# Altium project lightning_main.PrjPCB
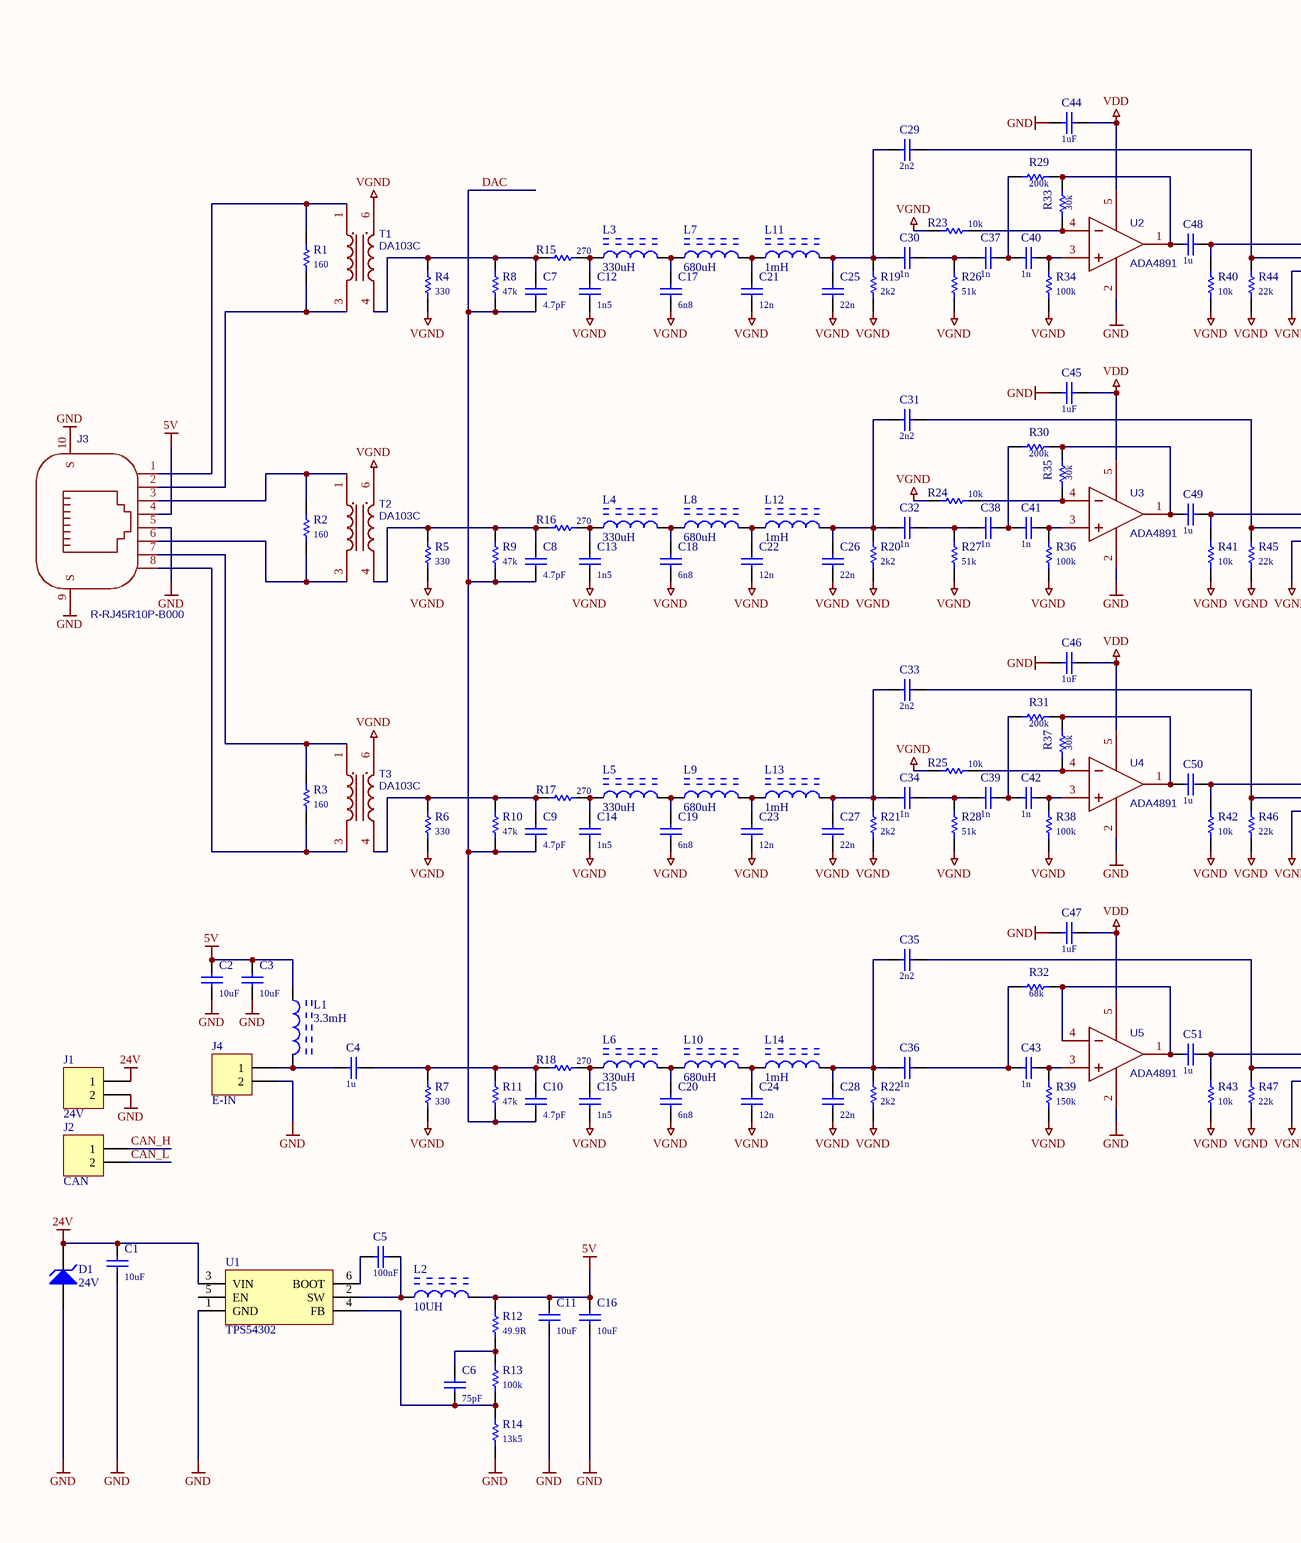
[diagram p0: schematic.SchDoc, left]
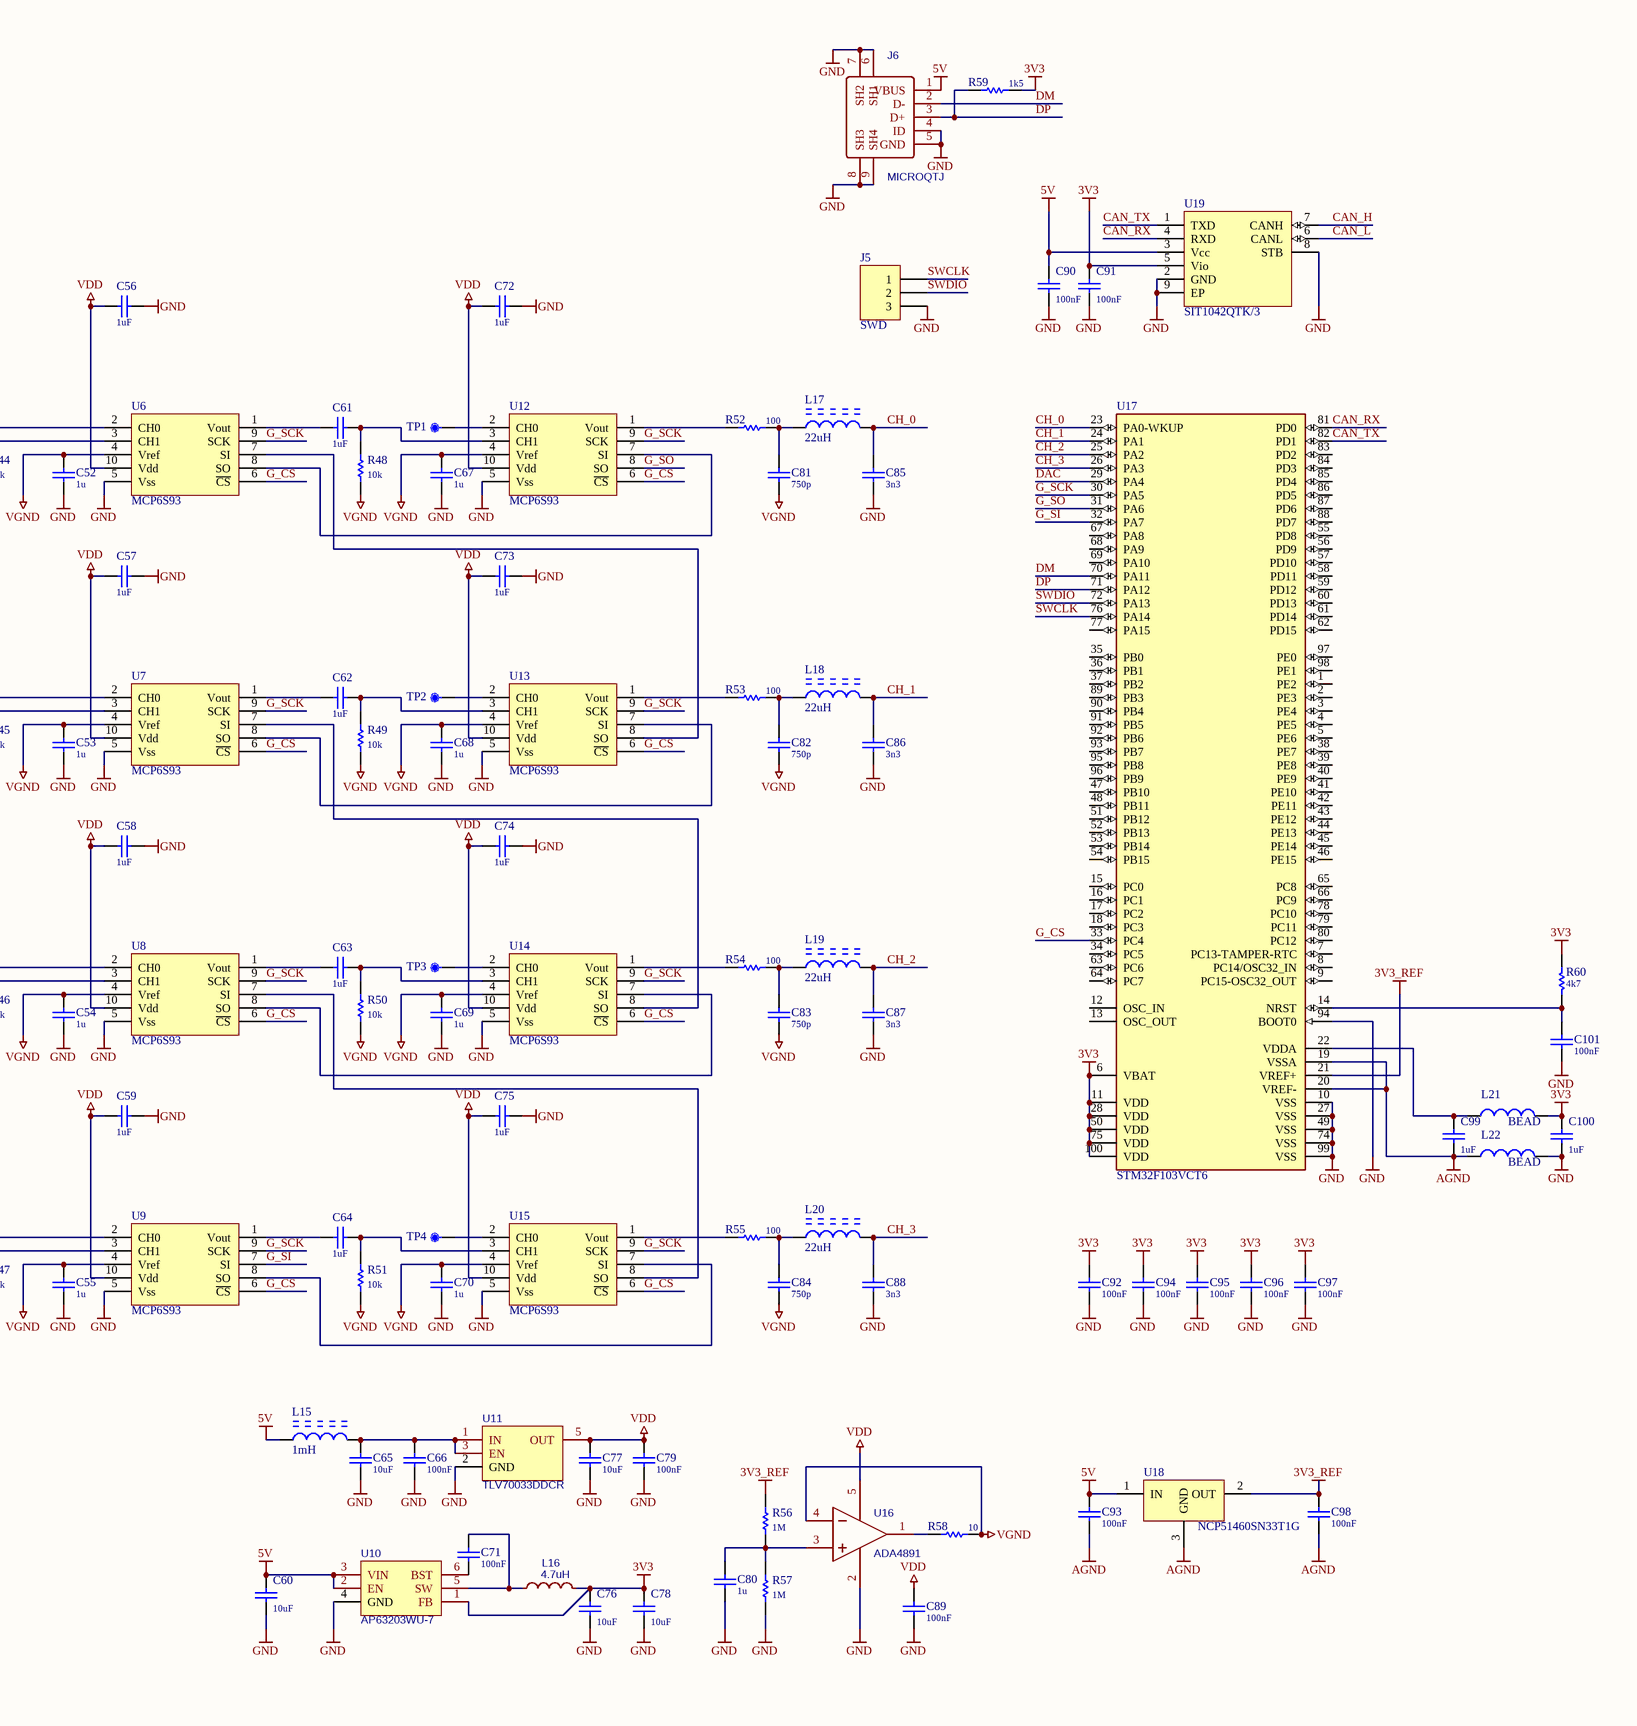
[diagram p1: schematic.SchDoc, right]
PRJ_VER: v1.0.0
1 sheet, 216 parts. Net scope: global (net labels, ports and power ports of the same name join across sheets).
Board file: board.PcbDoc

## Sheet schematic.SchDoc
size A2; SheetNumber: 6; SheetTotal: 29

### Parts
C1  10uF  [C1206]
C2  10uF  [C1206]
C3  10uF  [C1206]
C4  1u  [C0603]
C5  100nF  [C0603]
C6  75pF  [C0603]
C7  4.7pF  [C0603]
C8  4.7pF  [C0603]
C9  4.7pF  [C0603]
C10  4.7pF  [C0603]
C11  10uF  [C1206]
C12  1n5  [C0603]
C13  1n5  [C0603]
C14  1n5  [C0603]
C15  1n5  [C0603]
C16  10uF  [C1206]
C17  6n8  [C0603]
C18  6n8  [C0603]
C19  6n8  [C0603]
C20  6n8  [C0603]
C21  12n  [C0603]
C22  12n  [C0603]
C23  12n  [C0603]
C24  12n  [C0603]
C25  22n  [C0603]
C26  22n  [C0603]
C27  22n  [C0603]
C28  22n  [C0603]
C29  2n2  [C0603]
C30  1n  [C0603]
C31  2n2  [C0603]
C32  1n  [C0603]
C33  2n2  [C0603]
C34  1n  [C0603]
C35  2n2  [C0603]
C36  1n  [C0603]
C37  1n  [C0603]
C38  1n  [C0603]
C39  1n  [C0603]
C40  1n  [C0603]
C41  1n  [C0603]
C42  1n  [C0603]
C43  1n  [C0603]
C44  1uF  [C0603]
C45  1uF  [C0603]
C46  1uF  [C0603]
C47  1uF  [C0603]
C48  1u  [C0603]
C49  1u  [C0603]
C50  1u  [C0603]
C51  1u  [C0603]
C52  1u  [C0603]
C53  1u  [C0603]
C54  1u  [C0603]
C55  1u  [C0603]
C56  1uF  [C0603]
C57  1uF  [C0603]
C58  1uF  [C0603]
C59  1uF  [C0603]
C60  10uF  [C1206]
C61  1uF  [C0603]
C62  1uF  [C0603]
C63  1uF  [C0603]
C64  1uF  [C0603]
C65  10uF  [C0805]
C66  100nF  [C0603]
C67  1u  [C0603]
C68  1u  [C0603]
C69  1u  [C0603]
C70  1u  [C0603]
C71  100nF  [C0402]
C72  1uF  [C0603]
C73  1uF  [C0603]
C74  1uF  [C0603]
C75  1uF  [C0603]
C76  10uF  [C1206]
C77  10uF  [C0805]
C78  10uF  [C1206]
C79  100nF  [C0603]
C80  1u  [C0603]
C81  750p  [C0603]
C82  750p  [C0603]
C83  750p  [C0603]
C84  750p  [C0603]
C85  3n3  [C0603]
C86  3n3  [C0603]
C87  3n3  [C0603]
C88  3n3  [C0603]
C89  100nF  [C0603]
C90  100nF  [C0402]
C91  100nF  [C0402]
C92  100nF  [C0402]
C93  100nF  [C0603]
C94  100nF  [C0402]
C95  100nF  [C0402]
C96  100nF  [C0402]
C97  100nF  [C0402]
C98  100nF  [C0603]
C99  1uF  [C0603]
C100  1uF  [C0603]
C101  100nF  [C0402]
D1  24V  [SMB]
J1  24V  [CONN_DG308-2.54-2P]
J2  CAN  [CONN_DG308-2.54-2P]
J3  R-RJ45R10P-B000  [RJ45-TH_R-RJ45R10P-B000]
J4  E-IN  [CONN_F_TYPE]
J5  SWD  [HDR-1X3]  (no BOM)
J6  MICROQTJ  [MICRO-USB-SMD_MICROQTJ]
L1  3.3mH  [IND-TH_BD5.0-L10.5-P14.50-D0.6]
L2  10UH  [IND-SMD_L7.2-W6.6_GPSR07X0]
L3  330uH  [L1210]
L4  330uH  [L1210]
L5  330uH  [L1210]
L6  330uH  [L1210]
L7  680uH  [L1210]
L8  680uH  [L1210]
L9  680uH  [L1210]
L10  680uH  [L1210]
L11  1mH  [L1210]
L12  1mH  [L1210]
L13  1mH  [L1210]
L14  1mH  [L1210]
L15  1mH  [L1210]
L16  4.7uH  [IND-SMD_L4.4-W4.2]
L17  22uH  [L1210]
L18  22uH  [L1210]
L19  22uH  [L1210]
L20  22uH  [L1210]
L21  BEAD  [L0402]
L22  BEAD  [L0402]
R1  160  [R0603]
R2  160  [R0603]
R3  160  [R0603]
R4  330  [R0603]
R5  330  [R0603]
R6  330  [R0603]
R7  330  [R0603]
R8  47k  [R0603]
R9  47k  [R0603]
R10  47k  [R0603]
R11  47k  [R0603]
R12  49.9R  [R0603]
R13  100k  [R0603]
R14  13k5  [R0603]
R15  270  [R0603]
R16  270  [R0603]
R17  270  [R0603]
R18  270  [R0603]
R19  2k2  [R0603]
R20  2k2  [R0603]
R21  2k2  [R0603]
R22  2k2  [R0603]
R23  10k  [R0603]
R24  10k  [R0603]
R25  10k  [R0603]
R26  51k  [R0603]
R27  51k  [R0603]
R28  51k  [R0603]
R29  200k  [R0603]
R30  200k  [R0603]
R31  200k  [R0603]
R32  68k  [R0603]
R33  30k  [R0603]
R34  100k  [R0603]
R35  30k  [R0603]
R36  100k  [R0603]
R37  30k  [R0603]
R38  100k  [R0603]
R39  150k  [R0603]
R40  10k  [R0603]
R41  10k  [R0603]
R42  10k  [R0603]
R43  10k  [R0603]
R44  22k  [R0603]
R45  22k  [R0603]
R46  22k  [R0603]
R47  22k  [R0603]
R48  10k  [R0603]
R49  10k  [R0603]
R50  10k  [R0603]
R51  10k  [R0603]
R52  100  [R0603]
R53  100  [R0603]
R54  100  [R0603]
R55  100  [R0603]
R56  1M  [R0603]
R57  1M  [R0603]
R58  10  [R0805]
R59  1k5  [R0402]
R60  4k7  [R0402]
T1  DA103C  [TR_DA103C]
T2  DA103C  [TR_DA103C]
T3  DA103C  [TR_DA103C]
TP1  (no value)  [TP_TH_MICRO]  (no BOM)
TP2  (no value)  [TP_TH_MICRO]  (no BOM)
TP3  (no value)  [TP_TH_MICRO]  (no BOM)
TP4  (no value)  [TP_TH_MICRO]  (no BOM)
U1  TPS54302  [SOT-23-6]
U2  ADA4891  [SOT-23-5]
U3  ADA4891  [SOT-23-5]
U4  ADA4891  [SOT-23-5]
U5  ADA4891  [SOT-23-5]
U6  MCP6S93  [MSOP10]
U7  MCP6S93  [MSOP10]
U8  MCP6S93  [MSOP10]
U9  MCP6S93  [MSOP10]
U10  AP63203WU-7  [SOT-23-6]
U11  TLV70033DDCR  [SOT-23-5]
U12  MCP6S93  [MSOP10]
U13  MCP6S93  [MSOP10]
U14  MCP6S93  [MSOP10]
U15  MCP6S93  [MSOP10]
U16  ADA4891  [SOT-23-5]
U17  STM32F103VCT6  [LQFP-100]
U18  NCP51460SN33T1G  [SOT-23]
U19  SIT1042QTK/3  [DFN8_3X3_P065]

### Nets
3V3: C76.2 C78.2 C91.2 C92.2 C94.2 C95.2 C96.2 C97.2 C100.2 L16.2 L21.1 R59.1 R60.1 U10.1(FB) U17.6(VBAT) U17.11(VDD) U17.28(VDD) U17.50(VDD) U17.75(VDD) U17.100(VDD) U19.5(Vio)
3V3_REF: C98.2 R56.2 U17.21(VREF+) U18.2(OUT)
5V: C2.2 C3.2 C11.2 C16.2 C60.2 C90.2 C93.2 J3.4 J6.1(VBUS) L1.1 L2.2 L15.1 R12.1 U10.2(EN) U10.3(VIN) U18.1(IN) U19.3(Vcc)
24V: C1.2 D1.2(K) J1.1 U1.3(VIN)
AGND: C93.1 C98.1 C99.1 L22.2 U17.19(VSSA) U17.20(VREF-) U18.3(GND)
GND: C1.1 C2.1 C3.1 C11.1 C16.1 C44.1 C45.1 C46.1 C47.1 C52.2 C53.2 C54.2 C55.2 C56.1 C57.1 C58.1 C59.1 C60.1 C65.1 C66.1 C67.2 C68.2 C69.2 C70.2 C72.1 C73.1 C74.1 C75.1 C76.1 C77.1 C78.1 C79.1 C80.2 C85.2 C86.2 C87.2 C88.2 C89.1 C90.1 C91.1 C92.1 C94.1 C95.1 C96.1 C97.1 C100.1 C101.1 D1.1(A) J1.2 J3.5 J3.9(S) J3.10(S) J4.2 J5.3 J6.4(ID) J6.5(GND) J6.6(SH1) J6.7(SH2) J6.8(SH3) J6.9(SH4) L22.1 R14.2 R57.1 U1.1(GND) U2.2(-VS) U3.2(-VS) U4.2(-VS) U5.2(-VS) U6.5(Vss) U7.5(Vss) U8.5(Vss) U9.5(Vss) U10.4(GND) U11.2(GND) U12.5(Vss) U13.5(Vss) U14.5(Vss) U15.5(Vss) U16.2(-VS) U17.10(VSS) U17.27(VSS) U17.49(VSS) U17.74(VSS) U17.94(BOOT0) U17.99(VSS) U19.2(GND) U19.8(STB) U19.9(EP)
VDD: C44.2 C45.2 C46.2 C47.2 C56.2 C57.2 C58.2 C59.2 C72.2 C73.2 C74.2 C75.2 C77.2 C79.2 C89.2 U2.5(+VS) U3.5(+VS) U4.5(+VS) U5.5(+VS) U6.10(Vdd) U7.10(Vdd) U8.10(Vdd) U9.10(Vdd) U11.5(OUT) U12.10(Vdd) U13.10(Vdd) U14.10(Vdd) U15.10(Vdd) U16.5(+VS)
VGND: C12.1 C13.1 C14.1 C15.1 C17.1 C18.1 C19.1 C20.1 C21.1 C22.1 C23.1 C24.1 C25.1 C26.1 C27.1 C28.1 C52.1 C53.1 C54.1 C55.1 C67.1 C68.1 C69.1 C70.1 C81.2 C82.2 C83.2 C84.2 R4.1 R5.1 R6.1 R7.1 R19.1 R20.1 R21.1 R22.1 R23.2 R24.2 R25.2 R26.1 R27.1 R28.1 R34.1 R36.1 R38.1 R39.1 R40.1 R41.1 R42.1 R43.1 R44.1 R45.1 R46.1 R47.1 R48.1 R49.1 R50.1 R51.1 R58.1 T1.6 T2.6 T3.6 U6.4(Vref) U7.4(Vref) U8.4(Vref) U9.4(Vref) U12.4(Vref) U13.4(Vref) U14.4(Vref) U15.4(Vref) U16.4(-IN)
CAN_H: J2.1 U19.7(CANH)
CAN_L: J2.2 U19.6(CANL)
CAN_RX: U17.81(PD0) U19.4(RXD)
CAN_TX: U17.82(PD1) U19.1(TXD)
CH_0: C85.1 L17.2 U17.23(PA0-WKUP)
CH_1: C86.1 L18.2 U17.24(PA1)
CH_2: C87.1 L19.2 U17.25(PA2)
CH_3: C88.1 L20.2 U17.26(PA3)
DAC: C7.1 C8.1 C9.1 C10.1 R8.1 R9.1 R10.1 R11.1 U17.29(PA4)
DM: J6.2(D-) U17.70(PA11)
DP: J6.3(D+) R59.2 U17.71(PA12)
G_CS: U6.6(~{CS}) U7.6(~{CS}) U8.6(~{CS}) U9.6(~{CS}) U12.6(~{CS}) U13.6(~{CS}) U14.6(~{CS}) U15.6(~{CS}) U17.33(PC4)
G_SCK: U6.9(SCK) U7.9(SCK) U8.9(SCK) U9.9(SCK) U12.9(SCK) U13.9(SCK) U14.9(SCK) U15.9(SCK) U17.30(PA5)
G_SI: U9.7(SI) U17.32(PA7)
G_SO: U12.8(SO) U17.31(PA6)
SWCLK: J5.1 U17.76(PA14)
SWDIO: J5.2 U17.72(PA13)
NetC4_1: C4.1 C10.2 R7.2 R11.2 R18.2
NetC4_2: C4.2 J4.1 L1.2
NetC5_1: C5.1 U1.6(BOOT)
NetC5_2: C5.2 L2.1 U1.2(SW)
NetC6_1: C6.1 R13.2 R14.1 U1.4(FB)
NetC6_2: C6.2 R12.2 R13.1
NetC7_2: C7.2 R4.2 R8.2 R15.2 T1.4
NetC8_2: C8.2 R5.2 R9.2 R16.2 T2.4
NetC9_2: C9.2 R6.2 R10.2 R17.2 T3.4
NetC12_2: C12.2 L3.1 R15.1
NetC13_2: C13.2 L4.1 R16.1
NetC14_2: C14.2 L5.1 R17.1
NetC15_2: C15.2 L6.1 R18.1
NetC17_2: C17.2 L3.2 L7.1
NetC18_2: C18.2 L4.2 L8.1
NetC19_2: C19.2 L5.2 L9.1
NetC20_2: C20.2 L6.2 L10.1
NetC21_2: C21.2 L7.2 L11.1
NetC22_2: C22.2 L8.2 L12.1
NetC23_2: C23.2 L9.2 L13.1
NetC24_2: C24.2 L10.2 L14.1
NetC25_2: C25.2 C29.2 C30.2 L11.2 R19.2
NetC26_2: C26.2 C31.2 C32.2 L12.2 R20.2
NetC27_2: C27.2 C33.2 C34.2 L13.2 R21.2
NetC28_2: C28.2 C35.2 C36.2 L14.2 R22.2
NetC29_1: C29.1 R44.2 U6.3(CH1)
NetC30_1: C30.1 C37.2 R26.2
NetC31_1: C31.1 R45.2 U7.3(CH1)
NetC32_1: C32.1 C38.2 R27.2
NetC33_1: C33.1 R46.2 U8.3(CH1)
NetC34_1: C34.1 C39.2 R28.2
NetC35_1: C35.1 R47.2 U9.3(CH1)
NetC36_1: C36.1 C43.2 R32.2
NetC37_1: C37.1 C40.2 R29.2
NetC38_1: C38.1 C41.2 R30.2
NetC39_1: C39.1 C42.2 R31.2
NetC40_1: C40.1 R34.2 U2.3(+IN)
NetC41_1: C41.1 R36.2 U3.3(+IN)
NetC42_1: C42.1 R38.2 U4.3(+IN)
NetC43_1: C43.1 R39.2 U5.3(+IN)
NetC48_1: C48.1 R40.2 U6.2(CH0)
NetC48_2: C48.2 R29.1 R33.1 U2.1(OUT)
NetC49_1: C49.1 R41.2 U7.2(CH0)
NetC49_2: C49.2 R30.1 R35.1 U3.1(OUT)
NetC50_1: C50.1 R42.2 U8.2(CH0)
NetC50_2: C50.2 R31.1 R37.1 U4.1(OUT)
NetC51_1: C51.1 R43.2 U9.2(CH0)
NetC51_2: C51.2 R32.1 U5.1(OUT) U5.4(-IN)
NetC61_1: C61.1 R48.2 U12.3(CH1)
NetC61_2: C61.2 U6.1(Vout)
NetC62_1: C62.1 R49.2 U13.3(CH1)
NetC62_2: C62.2 U7.1(Vout)
NetC63_1: C63.1 R50.2 U14.3(CH1)
NetC63_2: C63.2 U8.1(Vout)
NetC64_1: C64.1 R51.2 U15.3(CH1)
NetC64_2: C64.2 U9.1(Vout)
NetC65_2: C65.2 C66.2 L15.2 U11.1(IN) U11.3(EN)
NetC71_1: C71.1 U10.6(BST)
NetC71_2: C71.2 L16.1 U10.5(SW)
NetC80_1: C80.1 R56.1 R57.2 U16.3(+IN)
NetC81_1: C81.1 L17.1 R52.1
NetC82_1: C82.1 L18.1 R53.1
NetC83_1: C83.1 L19.1 R54.1
NetC84_1: C84.1 L20.1 R55.1
NetC99_2: C99.2 L21.2 U17.22(VDDA)
NetC101_2: C101.2 R60.2 U17.14(NRST)
NetJ3_1: J3.1 R1.2 T1.1
NetJ3_2: J3.2 R1.1 T1.3
NetJ3_3: J3.3 R2.2 T2.1
NetJ3_6: J3.6 R2.1 T2.3
NetJ3_7: J3.7 R3.2 T3.1
NetJ3_8: J3.8 R3.1 T3.3
NetR23_1: R23.1 R33.2 U2.4(-IN)
NetR24_1: R24.1 R35.2 U3.4(-IN)
NetR25_1: R25.1 R37.2 U4.4(-IN)
NetR52_2: R52.2 U12.1(Vout)
NetR53_2: R53.2 U13.1(Vout)
NetR54_2: R54.2 U14.1(Vout)
NetR55_2: R55.2 U15.1(Vout)
NetR58_2: R58.2 U16.1(OUT)
NetTP1_1: TP1.1 U12.2(CH0)
NetTP2_1: TP2.1 U13.2(CH0)
NetTP3_1: TP3.1 U14.2(CH0)
NetTP4_1: TP4.1 U15.2(CH0)
NetU6_7: U6.7(SI) U13.8(SO)
NetU6_8: U6.8(SO) U12.7(SI)
NetU7_7: U7.7(SI) U14.8(SO)
NetU7_8: U7.8(SO) U13.7(SI)
NetU8_7: U8.7(SI) U15.8(SO)
NetU8_8: U8.8(SO) U14.7(SI)
NetU9_8: U9.8(SO) U15.7(SI)

Not connected (* = marked no-connect by the designer): U1 5(EN); U17 1(PE2) 2(PE3) 3(PE4) 4(PE5) 5(PE6) 7(PC13-TAMPER-RTC) 8(PC14/OSC32_IN) 9(PC15-OSC32_OUT) 12(OSC_IN) 13(OSC_OUT) 15(PC0) 16(PC1) 17(PC2) 18(PC3) 34(PC5) 35(PB0) 36(PB1) 37(PB2) 38(PE7) 39(PE8) 40(PE9) 41(PE10) 42(PE11) 43(PE12) 44(PE13) 45(PE14) 46(PE15) 47(PB10) 48(PB11) 51(PB12) 52(PB13) 53(PB14) 54(PB15) 55(PD8) 56(PD9) 57(PD10) 58(PD11) 59(PD12) 60(PD13) 61(PD14) 62(PD15) 63(PC6) 64(PC7) 65(PC8) 66(PC9) 67(PA8) 68(PA9) 69(PA10) 77(PA15) 78(PC10) 79(PC11) 80(PC12) 83(PD2) 84(PD3) 85(PD4) 86(PD5) 87(PD6) 88(PD7) 89(PB3) 90(PB4) 91(PB5) 92(PB6) 93(PB7) 95(PB8) 96(PB9) 97(PE0) 98(PE1)

### Library data of the parts
C1-C3 C11 C16 C60 C65 C76-C78 = CAP: 10uf 50V 1206
C4 C44-C59 C61-C64 C67-C70 C72-C75 C80 C99 C100 = CAP: 1u 0603
C5 C66 C79 C89 C93 C98 = CAP: 100nF 0603
C6 = CAP: 75pF 0603
C7-C10 = CAP: 4.7pF 0603
C12-C15 = CAP: 1n5 0603
C17-C20 = CAP: 6n8 0603
C21-C24 = CAP: 12nF 0603
C25-C28 = CAP: 22nF 0603
C29 C31 C33 C35 = CAP: 2n2 0603
C30 C32 C34 C36-C43 = CAP: 1n 0603
C71 C90-C92 C94-C97 C101 = CAP: 100nF 0402
C81-C84 = CAP: 750pF 0603
C85-C88 = CAP: 3n3 0603
D1 = SMCJ54A: P6SMB24A
J1 J2 = CONN MOLEX HDR-M 1x4: DG308-2.54-02P-14-00A(H)
J4 = CONN MOLEX HDR-M 1x4: -
J5 = Header 3
L1 = SRN3015-4R7M: CKL0510*3.3mH/K-A T
L2 = SRN3015-100M: CYA0630-10UH
L3-L6 = SRN3015-4R7M: NLCV32T-331K-PF
L7-L10 = SRN3015-4R7M: LQH32CN561K23L
L11-L15 = SRN3015-4R7M: NLFV32T-102K-EF
L16 = 4.7uH: FXL0420-4R7-M
L17-L20 = SRN3015-4R7M: NLCV32T-220K-PF
L21 L22 = BLM18AG601SN1D: BEAD 0402
R1-R3 = R0201: 160R 0603
R4-R7 = R0201: 330R 0603
R8-R11 = R0201: 47k 0603
R12 = R0201: 49R9 0603
R13 = RES: 100k 0603
R14 = RES: 13k7 0603
R15-R18 = R0201: 270R 0603
R19-R22 = R0201: 2k2 0603
R23-R25 R40-R43 R48-R51 = R0201: 10k 0603
R26-R28 = R0201: 51k 0603
R29-R31 = R0201: 200k 0603
R32 = R0201: 68k 0603
R33 R35 R37 = R0201: 30k 0603
R34 R36 R38 = R0201: 100k 0603
R39 = R0201: 150k 0603
R44-R47 = R0201: 22k 0603
R52-R55 = R0201: 100R 0603
R56 R57 = R0201: 1M 0603
R58 = R0201: 10R 0805
R59 = R0201: 1k5 0402
R60 = RES: 4k7 0402
T1-T3 = DLW43SH101XK2L
TP1-TP4 = TP_Dup1
U1 = LM27313XMFX: TPS54302DDCR
U2-U5 U16 = ADA4891-1ARJZ-R7
U19 = LTC2875